# EasyEDA schematic Main Board(v2).json
TITLE: Junior Bot (RP2040); REV: 1.0; Date: 2023-11-16; Sheet: 1/1; Drawn By: Ryan Bazzell; Company: Cedarville University
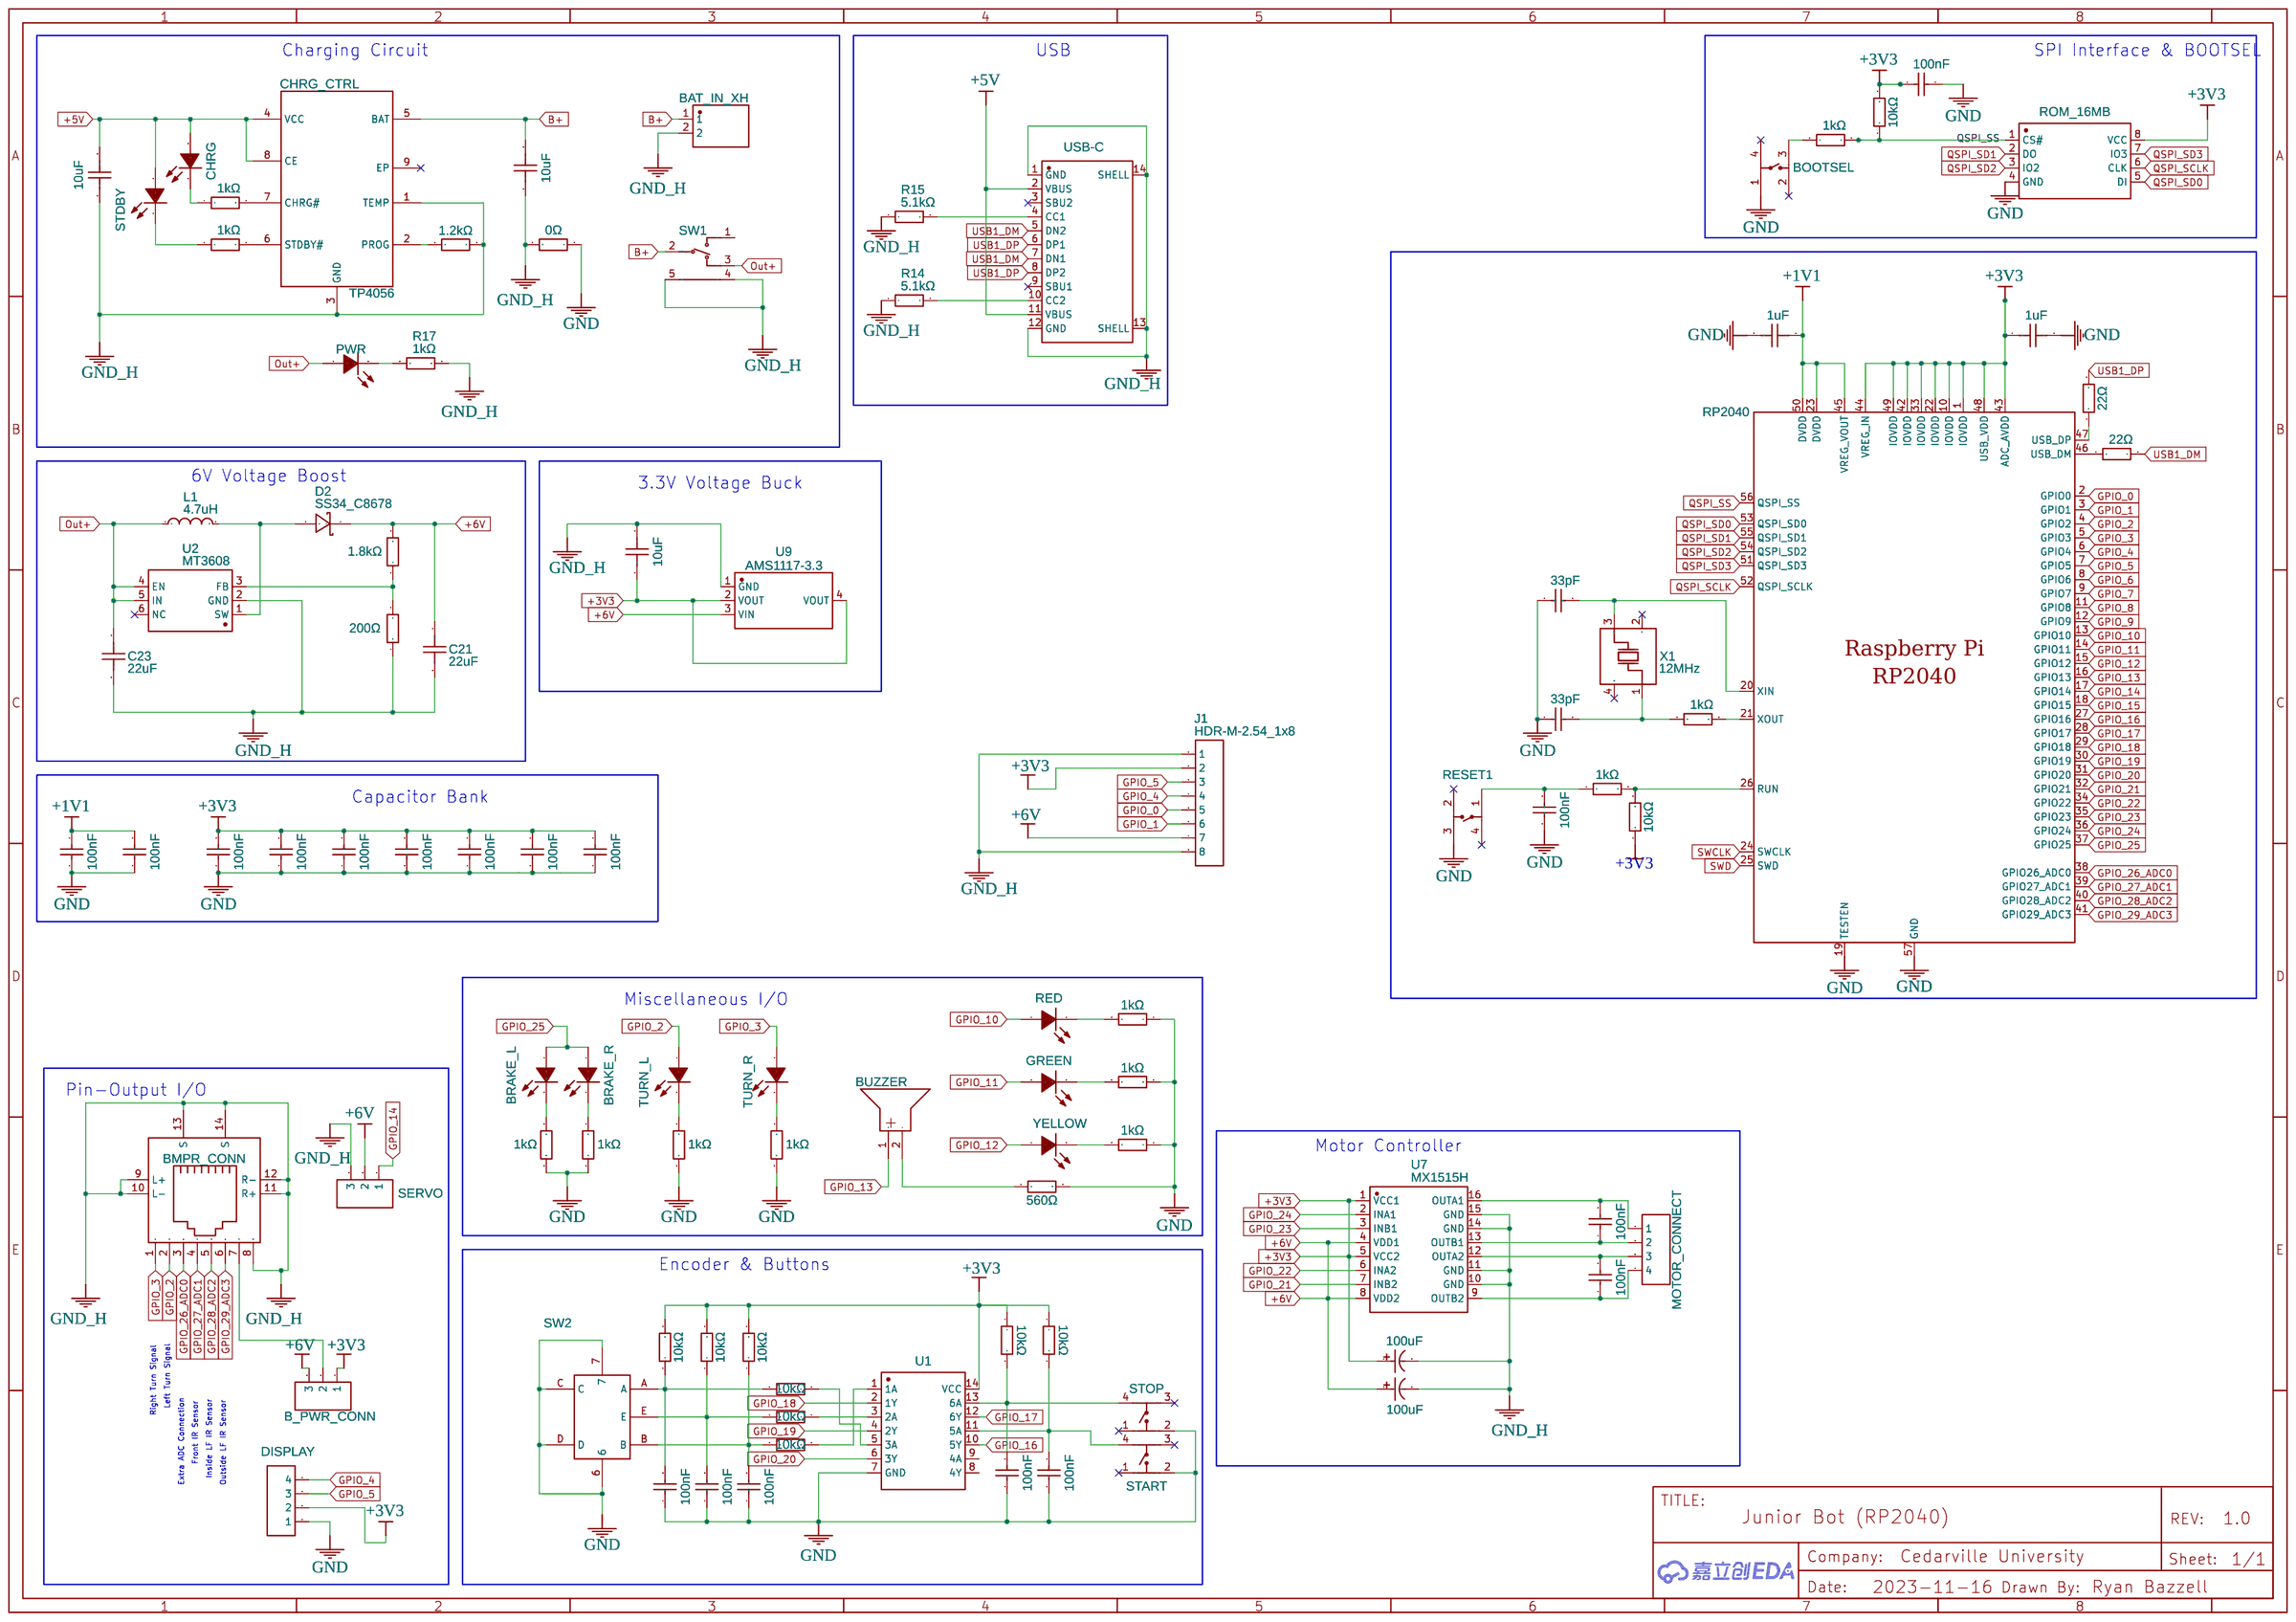
[diagram p0: schematic sheet]

## Parts
B_PWR_CONN  HDR-M-2.54_1x3  [HDR-M-2.54_1X3]
BAT_IN_XH  B2B-XH-A (LF)(SN)  [CONN-TH_B2B-XH-A-LF-SN]
BMPR_CONN  R-RJ45R08P-C000  [RJ45-TH_R-RJ45R08P-C000]
BOOTSEL  TD-1182SA-2.0H-250  [KEY-SMD_4P-L3.5-W3.0-P1.50-LS4.6]
BRAKE_L  E6C0805UR  [LED0805-R-RD]
BRAKE_R  E6C0805UR  [LED0805-R-RD]
BUZZER  3kHz  [BUZ-TH_BD9.0-P5.00-D0.6-FD]
C1  10uF  [C0603]
C2  33pF  [C0402]
C3  33pF  [C0402]
C4  100nF  [C0402]
C5  100nF  [C0402]
C6  100nF  [C0402]
C7  100nF  [C0402]
C8  1uF  [C0402]
C9  100nF  [C0402]
C10  1uF  [C0402]
C11  100nF  [C0402]
C12  100nF  [C0402]
C13  100nF  [C0402]
C14  100nF  [C0402]
C15  100nF  [C0402]
C16  100nF  [C0402]
C17  100nF  [C0402]
C18  10uF  [C0603]
C19  10uF  [C0603]
C21  22uF  [C0603]
C22  100nF  [C0402]
C23  22uF  [C0603]
C24  100nF  [C0402]
C25  100nF  [C0402]
C26  100uF  [CAP-SMD_BD6.3-L6.6-W6.6-LS7.2-R-RD]
C27  100uF  [CAP-SMD_BD6.3-L6.6-W6.6-LS7.2-R-RD]
C28  100nF  [C0402]
C29  100nF  [C0402]
C30  100nF  [C0402]
CHRG  FC-2012HRK-620D  [LED0805-R-RD]
CHRG_CTRL  TP4056  [ESOP-8_L4.9-W3.9-P1.27-LS6.0-BL-EP]
D2  SS34_C8678  [SMA_L4.3-W2.6-LS5.2-RD]
DISPLAY  DISPLAY  [HDR-F-2.54_1X4]
GREEN  0805G (Green)  [LED0805-R-RD]
J1  HDR-M-2.54_1x8  [HDR-M-2.54_1X8]
L1  4.7uH  [IND-SMD_L5.2-W5.2_YSPI0530]
MOTOR_CONNECT  HDR-F-2.54_1x4  [HDR-F-2.54_1X4]
PWR  0805G (Green)  [LED0805-R-RD]
R1  1kΩ  [R0402]
R2  10kΩ  [R0402]
R3  22Ω  [R0402]
R4  22Ω  [R0402]
R5  1kΩ  [R0402]
R7  1kΩ  [R0402]
R8  1kΩ  [R0402]
R9  1kΩ  [R0402]
R10  10kΩ  [R0402]
R11  1.8kΩ  [R0603]
R12  1.2kΩ  [R0402]
R13  1kΩ  [R0402]
R14  5.1kΩ  [R0402]
R15  5.1kΩ  [R0402]
R16  0Ω  [R0805]
R17  1kΩ  [R0402]
R19  200Ω  [R0603]
R20  1kΩ  [R0402]
R21  1kΩ  [R0402]
R22  10kΩ  [R0402]
R23  10kΩ  [R0402]
R24  1kΩ  [R0402]
R25  1kΩ  [R0402]
R26  1kΩ  [R0402]
R28  10kΩ  [R0402]
R29  10kΩ  [R0402]
R30  10kΩ  [R0402]
R31  10kΩ  [R0402]
R32  10kΩ  [R0402]
R33  10kΩ  [R0402]
R34  1kΩ  [R0402]
R35  560Ω  [R0603]
RED  FC-2012HRK-620D  [LED0805-R-RD]
RESET1  TD-1182SA-2.0H-250  [KEY-SMD_4P-L3.5-W3.0-P1.50-LS4.6]
ROM_16MB  W25Q128JVSIQTR  [SOIC-8_L5.3-W5.3-P1.27-LS8.0-BL]
SERVO  Servo  [HDR-M-2.54_1X3]
START  TSA063G60-250  [KEY-SMD_4P-L6.1-W6.1-P4.50-LS9.0]
STDBY  0805G (Green)  [LED0805-R-RD]
STOP  TSA063G60-250  [KEY-SMD_4P-L6.1-W6.1-P4.50-LS9.0]
SW1  ST-0-103-C03-N003-RS  [SW-TH_ST-0-103-C03-N003-RS]
SW2  EC12D1524403  [SW-TH_EC12D1524403]
TURN_L  17-21SUYC/TR8  [LED0805-R-RD]
TURN_R  17-21SUYC/TR8  [LED0805-R-RD]
U1  SN74HC14DR  [SOIC-14_L8.7-W3.9-P1.27-LS6.0-BL]
U2  MT3608  [SOT-23-6_L2.9-W1.6-P0.95-LS2.8-BL]
U3  RP2040  [LQFN-56_L7.0-W7.0-P0.4-EP]
U7  MX1515H  [SOP-16_L9.9-W3.9-P1.27-LS6.0-BL]
U9  AMS1117-3.3  [SOT-223-3_L6.5-W3.4-P2.30-LS7.0-BR]
USB-C  TYPE-C 16PIN 2MD(073)  [USB-C-SMD_TYPE-C-6PIN-2MD-073]
X1  12MHz  [OSC-SMD_4P-L3.2-W2.5-BL]
YELLOW  17-21SUYC/TR8  [LED0805-R-RD]

## Library data of the parts
B_PWR_CONN SERVO = HDR-M-2.54_1x3: Supplier Part: C180248; Supplier: LCSC; Contributor: LCEDA_Lib
BAT_IN_XH = B2B-XH-A (LF)(SN): Contributor: LCSC; Supplier: LCSC; Supplier Part: C158012; Manufacturer: JST; Manufacturer Part: B2B-XH-A(LF)(SN); JLCPCB Part Class: Extended Part; link: https://lcsc.com/eda_search?q=C158012&%26type=1&ref=editor
BMPR_CONN = R-RJ45R08P-C000: Contributor: LCSC; Supplier: LCSC; Supplier Part: C386757; Manufacturer: Ckmtw(灿科盟); JLCPCB Part Class: Extended Part
BOOTSEL RESET1 = TD-1182SA-2.0H-250: Supplier: LCSC; Supplier Part: C2905178; Manufacturer: DEALON(德艺隆); Contributor: LCSC; JLCPCB Part Class: Extended Part
BRAKE_L BRAKE_R = E6C0805UR: Supplier: LCSC; Manufacturer: KENTO; Supplier Part: C2295; JLCPCB Part Class: Extended Part; link: https://lcsc.com/eda_search?q=C2295&%26type=1&ref=editor
BUZZER = HNB09A03: Contributor: LCSC; Supplier: LCSC; Supplier Part: C96102; Manufacturer: 华能; JLCPCB Part Class: Extended Part; link: https://lcsc.com/eda_search?q=C96102&%26type=1&ref=editor
C1 C18 C19 = CL10A106KP8NNNC: Supplier: LCSC; Manufacturer: SAMSUNG(三星); Supplier Part: C19702; JLCPCB Part Class: Basic Part; link: https://lcsc.com/eda_search?q=C19702&%26type=1&ref=editor
C2 C3 = 0402CG330J500NT: Supplier: LCSC; Manufacturer: FH(风华); Supplier Part: C1562; JLCPCB Part Class: Basic Part
C4 C22 C24 C25 C28 = CL05B104KO5NNNC: Supplier: LCSC; Manufacturer: SAMSUNG(三星); Supplier Part: C1525; JLCPCB Part Class: Basic Part; link: https://lcsc.com/eda_search?q=C1525&%26type=1&ref=editor
C5-C7 C9 C11-C17 C29 C30 = CL05B104KO5NNNC: Supplier: LCSC; Manufacturer: SAMSUNG(三星); Supplier Part: C1525; JLCPCB Part Class: Basic Part
C8 C10 = CL05A105KA5NQNC: Supplier: LCSC; Manufacturer: SAMSUNG(三星); Supplier Part: C52923; JLCPCB Part Class: Basic Part
C21 C23 = CL10A226MQ8NRNC: Supplier: LCSC; Manufacturer: SAMSUNG(三星); Supplier Part: C59461; JLCPCB Part Class: Basic Part; link: https://lcsc.com/eda_search?q=C59461&%26type=1&ref=editor
C26 C27 = CS1C101M-CRE54: Supplier: LCSC; Manufacturer: ST(先科); Supplier Part: C97805; JLCPCB Part Class: Extended Part; link: https://lcsc.com/eda_search?q=C97805&%26type=1&ref=editor
CHRG RED = FC-2012HRK-620D: Supplier: LCSC; Manufacturer: 国星光电; Manufacturer Part: NCD0805R1; Supplier Part: C84256; JLCPCB Part Class: Basic Part; link: https://lcsc.com/eda_search?q=C84256&%26type=1&ref=editor
CHRG_CTRL = TP4056: Contributor: Guest; Supplier: LCSC; Manufacturer: TOPPOWER(南京拓微); Manufacturer Part: TP4056-42-ESOP8; Supplier Part: C16581; JLCPCB Part Class: Basic Part; link: https://lcsc.com/eda_search?q=C16581&%26type=1&ref=editor
D2 = SS34_C8678: Supplier: LCSC; Manufacturer Part: SS34; Manufacturer: MDD; Supplier Part: C8678; JLCPCB Part Class: Basic Part; link: https://lcsc.com/eda_search?q=C8678&%26type=1&ref=editor
DISPLAY MOTOR_CONNECT = HDR-F-2.54_1x4: Supplier Part: C225501; Supplier: LCSC; Contributor: LCEDA_Lib
GREEN STDBY = 0805G (Green): Supplier: LCSC; Manufacturer: KENTO; Manufacturer Part: KT-0805翠绿; Supplier Part: C2297; JLCPCB Part Class: Basic Part; link: https://lcsc.com/eda_search?q=C2297&%26type=1&ref=editor
J1 = HDR-M-2.54_1x8: Supplier Part: C190820; Supplier: LCSC; Contributor: LCEDA_Lib
L1 = MCS0530-4R7MN2: Contributor: LCSC; Supplier: LCSC; Supplier Part: C2836880; Manufacturer: PSA(信昌电陶); JLCPCB Part Class: Extended Part
PWR = 0805G (Green): Supplier: LCSC; Manufacturer: KENTO; Manufacturer Part: KT-0805黄灯; Supplier Part: C2296; JLCPCB Part Class: Basic Part; link: https://lcsc.com/eda_search?q=C2297&%26type=1&ref=editor
R1 R5 R8 R9 R13 R20 R21 R24-R26 = 0402WGF1001TCE: Supplier: LCSC; Manufacturer: UNI-ROYAL(厚声); Supplier Part: C11702; Resistance (Ohms): 1K; JLCPCB Part Class: Basic Part
R2 R10 = 0402WGF1002TCE: Supplier: LCSC; Manufacturer: UNI-ROYAL(厚声); Supplier Part: C25744; Resistance (Ohms): 10K; JLCPCB Part Class: Basic Part
R3 R4 = 0402WGF220JTCE: Supplier: LCSC; Manufacturer: UNI-ROYAL(厚声); Supplier Part: C25092; Resistance (Ohms): 22; JLCPCB Part Class: Basic Part
R7 R17 R34 = 0402WGF1001TCE: Supplier: LCSC; Manufacturer: UNI-ROYAL(厚声); Supplier Part: C11702; JLCPCB Part Class: Basic Part
R11 = 0603WAF1801T5E: Supplier: LCSC; Manufacturer: UNI-ROYAL(厚声); Supplier Part: C4177; JLCPCB Part Class: Basic Part
R12 = 0402WGF1201TCE: Supplier: LCSC; Manufacturer: UNI-ROYAL(厚声); Supplier Part: C25862; JLCPCB Part Class: Basic Part
R14 R15 = 0402WGF5101TCE: Supplier: LCSC; Manufacturer: UNI-ROYAL(厚声); Supplier Part: C25905; Resistance (Ohms): 5.1K; JLCPCB Part Class: Basic Part
R16 = 0805W8F0000T5E: Supplier: LCSC; Manufacturer: UNI-ROYAL(厚声); Supplier Part: C17477; JLCPCB Part Class: Basic Part
R19 = 0603WAF2000T5E: Supplier: LCSC; Manufacturer: UNI-ROYAL(厚声); Supplier Part: C8218; JLCPCB Part Class: Basic Part
R22 R23 R28-R33 = 0402WGF1002TCE: Supplier: LCSC; Manufacturer: UNI-ROYAL(厚声); Supplier Part: C25744; JLCPCB Part Class: Basic Part; link: https://lcsc.com/eda_search?q=C25744&%26type=1&ref=editor
R35 = 0603WAF5600T5E: Supplier: LCSC; Manufacturer: UNI-ROYAL(厚声); Supplier Part: C23204; JLCPCB Part Class: Basic Part
ROM_16MB = W25Q128JVSIQTR: Supplier: LCSC; Manufacturer: WINBOND(华邦); Manufacturer Part: W25Q128JVSIQ; Supplier Part: C97521; JLCPCB Part Class: Basic Part
START STOP = TSA063G60-250: Contributor: LCSC; Supplier: LCSC; Supplier Part: C294566; Manufacturer: BRIGHT(博瑞泰); JLCPCB Part Class: Extended Part; link: https://lcsc.com/eda_search?q=C294566&%26type=1&ref=editor
SW1 = ST-0-103-C03-N003-RS: Contributor: LCSC; Supplier: LCSC; Supplier Part: C1788490; Manufacturer: YUEN FUNG(源丰); JLCPCB Part Class: Extended Part; link: https://lcsc.com/eda_search?q=C1788490&%26type=1&ref=editor
SW2 = EC12D1524403: Supplier: LCSC; Manufacturer: ALPSALPINE(阿尔卑斯阿尔派); Supplier Part: C112349; JLCPCB Part Class: Extended Part
TURN_L TURN_R YELLOW = 17-21SUYC/TR8: Supplier: LCSC; Manufacturer: KENTO; Manufacturer Part: KT-0805黄灯; Supplier Part: C2296; JLCPCB Part Class: Basic Part; link: https://lcsc.com/eda_search?q=C2296&%26type=1&ref=editor
U1 = SN74HC14DR: Supplier: LCSC; Manufacturer: TI(德州仪器); Supplier Part: C6820; JLCPCB Part Class: Extended Part; link: https://lcsc.com/eda_search?q=C6820&%26type=1&ref=editor
U2 = MT3608: Supplier: LCSC; Manufacturer: 西安航天民芯; Supplier Part: C84817; JLCPCB Part Class: Extended Part
U3 = RP2040: Supplier: LCSC; Supplier Part: C2040; Manufacturer: Raspberry Pi(树莓派); JLCPCB Part Class: Extended Part; Contributor: LCSC
U7 = MX1515H: Contributor: lcsc; Supplier: LCSC; Supplier Part: C5119046; Manufacturer: Mixic(中科芯亿达); JLCPCB Part Class: Extended Part; link: https://lcsc.com/eda_search?q=C5119046&%26type=1&ref=editor
U9 = AMS1117-3.3: sourceId: dwIGgezVh; Supplier: LCSC; Manufacturer: AMS; Supplier Part: C6186; JLCPCB Part Class: Basic Part
USB-C = TYPE-C 16PIN 2MD(073): Supplier: LCSC; Supplier Part: C2765186; Manufacturer: SHOU HAN(首韩); Contributor: LCSC; JLCPCB Part Class: Extended Part
X1 = X322512MSB4SI: Supplier: LCSC; Manufacturer: YXC(扬兴晶振); Supplier Part: C9002; JLCPCB Part Class: Basic Part; link: https://lcsc.com/eda_search?q=C9002&%26type=1&ref=editor

## Nets
+1V1: C6.2 C7.2 C8.1 U3.23(DVDD) U3.45(VREG_VOUT) U3.50(DVDD)
+3V3: B_PWR_CONN.1 C5.2 C9.2 C10.1 C11.2 C12.2 C13.2 C14.2 C15.2 C16.2 C18.1 C27.1 DISPLAY.2 J1.2 R2.2 R10.1 R22.2 R23.2 R28.2 R29.1 R30.1 ROM_16MB.8(VCC) U1.14(VCC) U3.1(IOVDD) U3.10(IOVDD) U3.22(IOVDD) U3.33(IOVDD) U3.42(IOVDD) U3.43(ADC_AVDD) U3.44(VREG_IN) U3.48(USB_VDD) U3.49(IOVDD) U7.1(VCC1) U7.5(VCC2) U9.2(VOUT) U9.4(VOUT)
+5V: C19.2 CHRG.1(+) CHRG_CTRL.4(VCC) CHRG_CTRL.8(CE) STDBY.1(A) USB-C.2(VBUS) USB-C.11(VBUS)
+6V: B_PWR_CONN.3 C21.1 C26.1 D2.1(K) J1.7 R11.2 SERVO.2 U7.4(VDD1) U7.8(VDD2) U9.3(VIN)
GND: BOOTSEL.1 C2.1 C3.1 C4.1 C5.1 C6.1 C7.1 C8.2 C9.1 C10.2 C11.1 C12.1 C13.1 C14.1 C15.1 C16.1 C17.1 C22.1 C24.1 C25.1 C28.1 DISPLAY.1 R8.2 R13.1 R16.2 R20.1 R21.1 R24.2 R25.2 R26.2 R35.2 RESET1.3 ROM_16MB.4(GND) START.2 STOP.2 SW2.6 SW2.7 SW2.C SW2.D U1.7(GND) U3.19(TESTEN) U3.57(GND)
GND_H: BAT_IN_XH.2 BMPR_CONN.8 BMPR_CONN.9(L+) BMPR_CONN.10(L-) BMPR_CONN.11(R+) BMPR_CONN.12(R-) BMPR_CONN.13(S) BMPR_CONN.14(S) C1.1 C18.2 C19.1 C21.2 C23.2 C26.2 C27.2 CHRG_CTRL.1(TEMP) CHRG_CTRL.3(GND) J1.1 J1.8 R12.2 R14.1 R15.1 R16.1 R17.2 R19.1 SERVO.3 SW1.4 SW1.5 U2.2(GND) U7.10(GND) U7.11(GND) U7.14(GND) U7.15(GND) U9.1(GND) USB-C.1(GND) USB-C.12(GND) USB-C.13(SHELL) USB-C.14(SHELL)
B+: BAT_IN_XH.1 C1.2 CHRG_CTRL.5(BAT) SW1.2
GPIO_0: J1.5 U3.2(GPIO0)
GPIO_1: J1.6 U3.3(GPIO1)
GPIO_2: BMPR_CONN.2 TURN_L.1(+) U3.4(GPIO2)
GPIO_3: BMPR_CONN.1 TURN_R.1(+) U3.5(GPIO3)
GPIO_4: DISPLAY.4 J1.4 U3.6(GPIO4)
GPIO_5: DISPLAY.3 J1.3 U3.7(GPIO5)
GPIO_6: U3.8(GPIO6)
GPIO_7: U3.9(GPIO7)
GPIO_8: U3.11(GPIO8)
GPIO_9: U3.12(GPIO9)
GPIO_10: RED.1(+) U3.13(GPIO10)
GPIO_11: GREEN.1(A) U3.14(GPIO11)
GPIO_12: U3.15(GPIO12) YELLOW.1(+)
GPIO_13: BUZZER.1(+) U3.16(GPIO13)
GPIO_14: SERVO.1 U3.17(GPIO14)
GPIO_15: U3.18(GPIO15)
GPIO_16: U1.10(5Y) U3.27(GPIO16)
GPIO_17: U1.12(6Y) U3.28(GPIO17)
GPIO_18: U1.2(1Y) U3.29(GPIO18)
GPIO_19: U1.4(2Y) U3.30(GPIO19)
GPIO_20: U1.6(3Y) U3.31(GPIO20)
GPIO_21: U3.32(GPIO21) U7.7(INB2)
GPIO_22: U3.34(GPIO22) U7.6(INA2)
GPIO_23: U3.35(GPIO23) U7.3(INB1)
GPIO_24: U3.36(GPIO24) U7.2(INA1)
GPIO_25: BRAKE_L.1(A) BRAKE_R.1(A) U3.37(GPIO25)
GPIO_26_ADC0: BMPR_CONN.3 U3.38(GPIO26_ADC0)
GPIO_27_ADC1: BMPR_CONN.4 U3.39(GPIO27_ADC1)
GPIO_28_ADC2: BMPR_CONN.5 U3.40(GPIO28_ADC2)
GPIO_29_ADC3: BMPR_CONN.6 U3.41(GPIO29_ADC3)
Out+: C23.1 L1.1 PWR.1(A) SW1.3 U2.4(EN) U2.5(IN)
QSPI_SCLK: ROM_16MB.6(CLK) U3.52(QSPI_SCLK)
QSPI_SD0: ROM_16MB.5(DI) U3.53(QSPI_SD0)
QSPI_SD1: ROM_16MB.2(DO) U3.55(QSPI_SD1)
QSPI_SD2: ROM_16MB.3(IO2) U3.54(QSPI_SD2)
QSPI_SD3: ROM_16MB.7(IO3) U3.51(QSPI_SD3)
QSPI_SS: R1.2 R2.1 ROM_16MB.1(CS#) U3.56(QSPI_SS)
SWCLK: U3.24(SWCLK)
SWD: U3.25(SWD)
USB1_DM: R4.2 USB-C.5(DN2) USB-C.7(DN1)
USB1_DP: R3.2 USB-C.6(DP1) USB-C.8(DP2)
Net-(B_PWR_CONN-2): B_PWR_CONN.2 BMPR_CONN.7
Net-(BOOTSEL-3): BOOTSEL.3 R1.1
Net-(BRAKE_L-2): BRAKE_L.2(K) R8.1
Net-(BRAKE_R-2): BRAKE_R.2(K) R24.1
Net-(BUZZER-2): BUZZER.2(-) R35.1
Net-(C2-2): C2.2 U3.20(XIN) X1.3(OSC2)
Net-(C3-2): C3.2 R5.1 X1.1(OSC1)
Net-(C4-2): C4.2 R29.2 START.4 U1.11(5A)
Net-(C17-2): C17.2 R9.1 RESET1.1
Net-(C22-2): C22.2 R28.1 R33.2 SW2.B
Net-(C24-2): C24.2 R23.1 R32.2 SW2.E
Net-(C25-2): C25.2 R22.1 R31.2 SW2.A
Net-(C28-2): C28.2 R30.2 STOP.4 U1.13(6A)
Net-(C29-1): C29.1 MOTOR_CONNECT.2 U7.13(OUTB1)
Net-(C29-2): C29.2 MOTOR_CONNECT.1 U7.16(OUTA1)
Net-(C30-1): C30.1 MOTOR_CONNECT.4 U7.9(OUTB2)
Net-(C30-2): C30.2 MOTOR_CONNECT.3 U7.12(OUTA2)
Net-(CHRG-2): CHRG.2(-) R7.1
Net-(CHRG_CTRL-2): CHRG_CTRL.2(PROG) R12.1
Net-(CHRG_CTRL-6): CHRG_CTRL.6(STDBY#) R34.2
Net-(CHRG_CTRL-7): CHRG_CTRL.7(CHRG#) R7.2
Net-(D2-2): D2.2(A) L1.2 U2.1(SW)
Net-(GREEN-2): GREEN.2(K) R21.2
Net-(PWR-2): PWR.2(K) R17.1
Net-(R3-1): R3.1 U3.47(USB_DP)
Net-(R4-1): R4.1 U3.46(USB_DM)
Net-(R5-2): R5.2 U3.21(XOUT)
Net-(R9-2): R9.2 R10.2 U3.26(RUN)
Net-(R11-1): R11.1 R19.2 U2.3(FB)
Net-(R13-2): R13.2 YELLOW.2(-)
Net-(R14-2): R14.2 USB-C.10(CC2)
Net-(R15-2): R15.2 USB-C.4(CC1)
Net-(R20-2): R20.2 RED.2(-)
Net-(R25-1): R25.1 TURN_L.2(-)
Net-(R26-1): R26.1 TURN_R.2(-)
Net-(R31-1): R31.1 U1.5(3A)
Net-(R32-1): R32.1 U1.3(2A)
Net-(R33-1): R33.1 U1.1(1A)
Net-(R34-1): R34.1 STDBY.2(K)

Not connected (* = marked no-connect by the designer): BOOTSEL 2* 4*; CHRG_CTRL 9(EP)*; RESET1 2* 4*; START 1* 3*; STOP 1* 3*; SW1 1; U1 8(4Y) 9(4A); U2 6(NC)*; USB-C 3(SBU2)* 9(SBU1)*; X1 2(GND)* 4(GND)*

## Notes on the sheet
- Charging Circuit
- USB
- SPI Interface & BOOTSEL
- 6V Voltage Boost
- 3.3V Voltage Buck
- Capacitor Bank
- Miscellaneous I/O
- Pin-Output I/O
- Motor Controller
- Encoder & Buttons
- Left Turn Signal
- Right Turn Signal
- Front IR Sensor
- Inside LF IR Sensor
- Extra ADC Connection
- Outside LF IR Sensor
